# Altium project PCB LED_MonitorFluorecente.PrjPcb
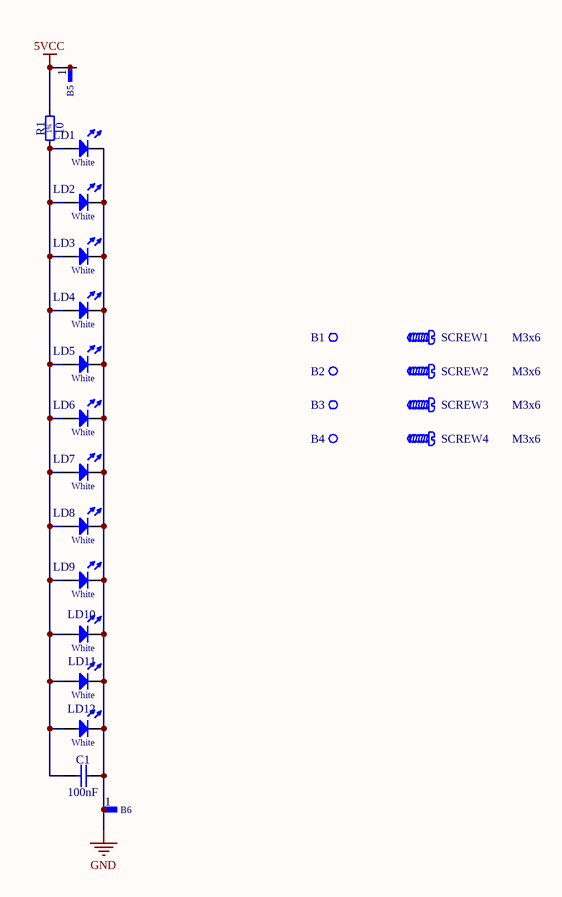
[diagram p0: PCB LED_MonitorFluorecente.SchDoc]
1 sheet, 24 parts. Net scope: global (net labels, ports and power ports of the same name join across sheets).
Board file: PCB LED_MonitorFluorecente.PcbDoc

## Sheet PCB LED_MonitorFluorecente.SchDoc
size A4

### Parts
B1  Plated Hole  [MTG320_1050]  (value not drawn)
B2  Plated Hole  [MTG320_1050]  (value not drawn)
B3  Plated Hole  [MTG320_1050]  (value not drawn)
B4  Plated Hole  [MTG320_1050]  (value not drawn)
B5  SMD Pad  [R400X300]  (value not drawn)
B6  SMD Pad  [R400X300]  (value not drawn)
C1  100nF  [CAPC2012X135N]
LD1  White  [LED_OSRAM_GW_JTLPS1.EM]  (value not drawn)
LD2  White  [LED_OSRAM_GW_JTLPS1.EM]  (value not drawn)
LD3  White  [LED_OSRAM_GW_JTLPS1.EM]  (value not drawn)
LD4  White  [LED_OSRAM_GW_JTLPS1.EM]  (value not drawn)
LD5  White  [LED_OSRAM_GW_JTLPS1.EM]  (value not drawn)
LD6  White  [LED_OSRAM_GW_JTLPS1.EM]  (value not drawn)
LD7  White  [LED_OSRAM_GW_JTLPS1.EM]  (value not drawn)
LD8  White  [LED_OSRAM_GW_JTLPS1.EM]  (value not drawn)
LD9  White  [LED_OSRAM_GW_JTLPS1.EM]  (value not drawn)
LD10  White  [LED_OSRAM_GW_JTLPS1.EM]  (value not drawn)
LD11  White  [LED_OSRAM_GW_JTLPS1.EM]  (value not drawn)
LD12  White  [LED_OSRAM_GW_JTLPS1.EM]  (value not drawn)
R1  10  [RESC3216X65N]
SCREW1  M3x6  [BOSSARD_BN1061-1401173_v]
SCREW2  M3x6  [BOSSARD_BN1061-1401173_v]
SCREW3  M3x6  [BOSSARD_BN1061-1401173_v]
SCREW4  M3x6  [BOSSARD_BN1061-1401173_v]

### Nets
5VCC: B5.1 R1.2
GND: B6.1 C1.2 LD1.1(C) LD2.1(C) LD3.1(C) LD4.1(C) LD5.1(C) LD6.1(C) LD7.1(C) LD8.1(C) LD9.1(C) LD10.1(C) LD11.1(C) LD12.1(C)
NetC1_1: C1.1 LD1.2(A) LD2.2(A) LD3.2(A) LD4.2(A) LD5.2(A) LD6.2(A) LD7.2(A) LD8.2(A) LD9.2(A) LD10.2(A) LD11.2(A) LD12.2(A) R1.1

Not connected (* = marked no-connect by the designer): B1 1; B2 1; B3 1; B4 1

### Notes on the sheet
- (in symbol R1206_10R_1%_0.25W_200PPM) 1%

### Library data of the parts
B1-B4 = PLATED_HOLE3.2_PAD10.5: Single Terminal Socket; Part Description: Plated Through Hole: Hole Dia.=3.2mm Pad Dia.=10.5mm; Mounted: No; Part Number: PLATED_HOLE3.2_PAD10.5; Component Kind: Standard (No BOM); Component Type: Standard (No BOM); Pin Count: 1; Family: Plated Hole; Socket: No; SMD: No; Sense: No; Status: None; ComponentHeight: 0mm; HelpURL: Undefined; Author: CERN DEM JMW; CreateDate: 27/09/2011; LatestRevisionDate: 27/09/2011; PackageDescription: Plated Through Hole: Hole Dia.=3.2mm Pad Dia.=10.5mm
B5 B6 = SMD_PAD_4X3MM: Single SMD Pad; Part Description: 4mm x 3mm SMD Pad; Mounted: No; Part Number: SMD_PAD_4X3MM; Component Kind: Standard (No BOM); Component Type: Standard (No BOM); Pin Count: 1; Family: SMD Pad; Socket: No; SMD: No; Sense: No; Status: None; ComponentHeight: 0mm; HelpURL: Undefined; Author: CERN DEM JLC; CreateDate: 15/03/2010; LatestRevisionDate: 15/03/2010; PackageDescription: 4mm x  3mm SMD Pad
C1 = CC0805_100NF_50V_10%_X7R: Non-polarised capacitor; Part Description: SMD Multilayer Chip Ceramic Capacitor; Manufacturer: GENERIC; Manufacturer1 Part Number: C2012X7R1H104K085AA; Voltage: 50V; TC: X7R; Tolerance: ±10%; Part Number: CC0805_100NF_50V_10%_X7R; Component Kind: Standard; Component Type: Standard; Pin Count: 2; Value: 100nF; Status: Preferred; Manufacturer Part Number: CC0805_100NF_50V_10%_X7R; Case: 0805; Mounted: Yes; Socket: No; SMD: Yes; Sense: No; Manufacturer1 Example: TDK; Manufacturer1 ComponentHeight: 1mm; HelpURL: \\cern.ch\dfs\Applications\Altium\Datasheets\CC0805_X7R_TDK_C.pdf; Author: CERN DEM JLC; CreateDate: 03/12/2007; LatestRevisionDate: 22/04/2015
LD1-LD12 = GW JTLPS1.EM-KKKM-XX55-1-150-R33: LED White 1C 2A; Manufacturer: OSRAM; Part Description: High Power LEDs - White White 4000K CRI 80 DURIS E 2835; PressFit: No; Bonding: No; Color: White; ComponentHeight: 0.65mm; Manufacturer Part Number: GW JTLPS1.EM-KKKM-XX55-1-150-R33; Part Number: GW JTLPS1.EM-KKKM-XX55-1-150-R33; Component Kind: Standard; Component Type: Standard; PackageDescription: SMD White LED, 2-Leads, Body 3.5x2.8mm, GW JTLPS1.EM Series; Pin Count: 2; Mounted: Yes; Socket: No; SMD: Yes; Sense: No; Author: LNLS DIG LOS; CreateDate: 26/02/2018; LatestRevisionDate: 26/02/2018
R1 = R1206_10R_1%_0.25W_200PPM: Resistor - 1%; Part Description: General Purpose Thick Film Chip Resistor; Manufacturer: GENERIC; Manufacturer1 Part Number: NRC12F10R0TRF; Power: 0.25W; TC: ±200ppm/°C; Part Number: R1206_10R_1%_0.25W_200PPM; Component Kind: Standard; Component Type: Standard; Pin Count: 2; Value: 10; Status: Preferred; Tolerance: ±1%; Manufacturer Part Number: R1206_10R_1%_0.25W_200PPM; Case: 1206; Mounted: Yes; Sense: No; Socket: No; SMD: Yes; Manufacturer1 Example: NIC COMPONENT; Manufacturer1 ComponentHeight: 0.65mm; HelpURL: \\cern.ch\dfs\Applications\Altium\Datasheets\R1206_NIC_NRC.pdf; Author: CERN DEM JLC; CreateDate: 24/06/2009; LatestRevisionDate: 24/06/2009
SCREW1-SCREW4 = BOSSARD_BN1061-1401173_v: Slotted Pan Head Screw; Part Description: M3 L=6mm Slotted Pan Head Machine Screw, Polyamide PA 6.6; Manufacturer Part Number: BN1061 Art.1401173; PressFit: No; Part Number: BOSSARD_BN1061-1401173_v; Component Kind: Standard; Component Type: Mechanical; Pin Count: 0; PackageDescription: M3 L=6mm Slotted Pan Head Machine Screw, Polyamide PA 6.6; Mounted: Yes; Socket: No; SMD: No; Sense: No; Status: None; Value: M3x6; Manufacturer: BOSSARD; ComponentHeight: 2mm; HelpURL: \\cern.ch\dfs\Applications\Altium\Datasheets\BOSSARD_BN1061-1401173.pdf; Author: CERN DEM JMW; CreateDate: 18/06/2015; LatestRevisionDate: 18/06/2015